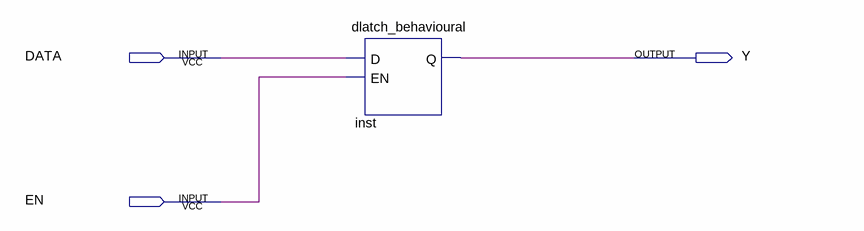
[diagram p0: schematic sheet]
// Quartus schematic behavioural.bdf as structural Verilog: 1 symbols, 3 pins
module behavioural (
  input  DATA,
  input  EN,
  output Y
);

  dlatch_behavioural inst (.D(DATA), .EN(EN), .Q(Y));
endmodule
